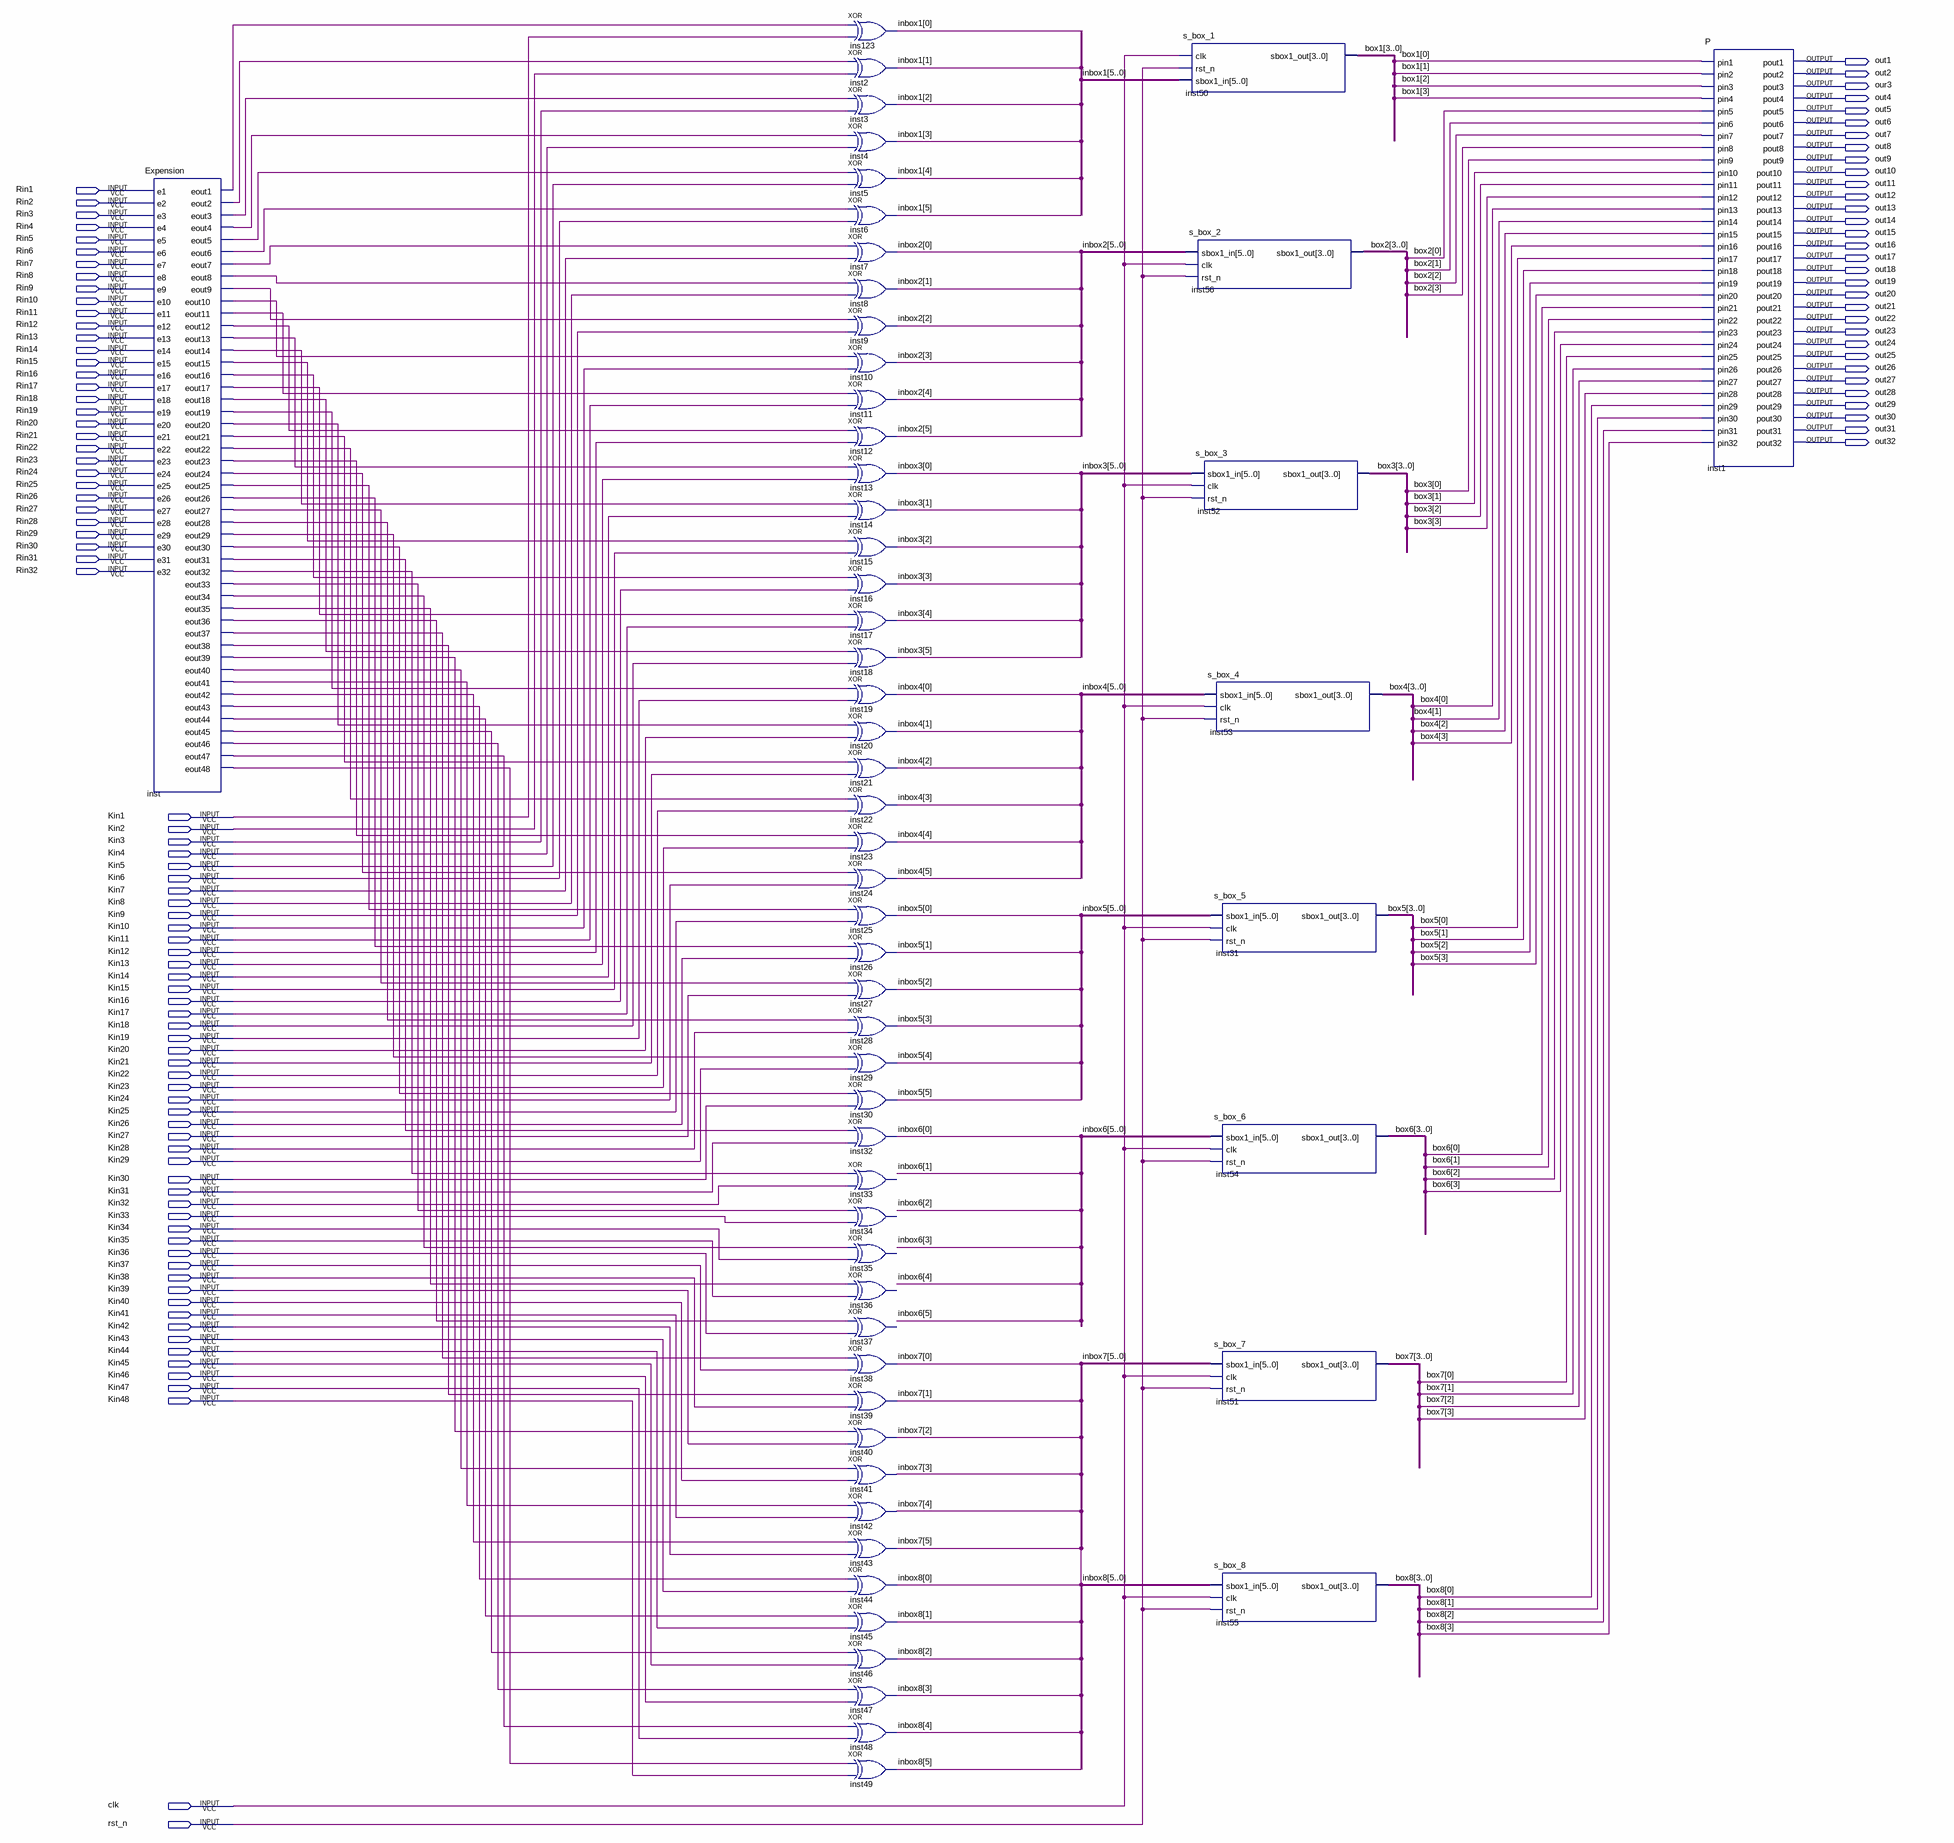
[diagram p0: schematic sheet]
// Quartus schematic f_module.bdf as structural Verilog: 58 symbols, 114 pins
module f_module (
  input  Rin1,
  input  Rin2,
  input  Rin3,
  input  Rin4,
  input  Rin5,
  input  Rin6,
  input  Rin7,
  input  Rin8,
  input  Rin9,
  input  Rin10,
  input  Rin11,
  input  Rin12,
  input  Rin13,
  input  Rin14,
  input  Rin15,
  input  Rin16,
  input  Rin17,
  input  Rin18,
  input  Rin19,
  input  Rin20,
  input  Rin21,
  input  Rin22,
  input  Rin23,
  input  Rin24,
  input  Rin25,
  input  Rin26,
  input  Rin27,
  input  Rin28,
  input  Rin29,
  input  Rin30,
  input  Rin31,
  input  Rin32,
  input  Kin1,
  input  Kin2,
  input  Kin3,
  input  Kin4,
  input  Kin5,
  input  Kin6,
  input  Kin7,
  input  Kin8,
  input  Kin9,
  input  Kin10,
  input  Kin11,
  input  Kin12,
  input  Kin13,
  input  Kin14,
  input  Kin15,
  input  Kin16,
  input  Kin17,
  input  Kin18,
  input  Kin19,
  input  Kin20,
  input  Kin21,
  input  Kin22,
  input  Kin23,
  input  Kin24,
  input  Kin25,
  input  Kin26,
  input  Kin27,
  input  Kin28,
  input  Kin29,
  input  Kin30,
  input  Kin31,
  input  Kin32,
  input  Kin33,
  input  Kin34,
  input  Kin35,
  input  Kin36,
  input  Kin37,
  input  Kin38,
  input  Kin39,
  input  Kin40,
  input  Kin41,
  input  Kin42,
  input  Kin43,
  input  Kin44,
  input  Kin45,
  input  Kin46,
  input  Kin47,
  input  Kin48,
  input  clk,
  input  rst_n,
  output out1,
  output out2,
  output our3,
  output out4,
  output out5,
  output out6,
  output out7,
  output out8,
  output out9,
  output out10,
  output out11,
  output out12,
  output out13,
  output out14,
  output out15,
  output out16,
  output out17,
  output out18,
  output out19,
  output out20,
  output out21,
  output out22,
  output out23,
  output out24,
  output out25,
  output out26,
  output out27,
  output out28,
  output out29,
  output out30,
  output out31,
  output out32
);

  wire inst_eout1, inst_eout2, inst_eout3, inst_eout4, inst_eout5, inst_eout6, inst_eout7, inst_eout8,
       inst_eout9, inst_eout10, inst_eout11, inst_eout12, inst_eout13, inst_eout14, inst_eout15, inst_eout16,
       inst_eout17, inst_eout18, inst_eout19, inst_eout20, inst_eout21, inst_eout22, inst_eout23,
       inst_eout24, inst_eout25, inst_eout26, inst_eout27, inst_eout28, inst_eout29, inst_eout30,
       inst_eout31, inst_eout32, inst_eout33, inst_eout34, inst_eout35, inst_eout36, inst_eout37,
       inst_eout38, inst_eout39, inst_eout40, inst_eout41, inst_eout42, inst_eout43, inst_eout44,
       inst_eout45, inst_eout46, inst_eout47, inst_eout48;
  wire [3:0] box1, box2, box3, box4, box5, box6, box7, box8;
  wire [5:0] inbox1, inbox2, inbox3, inbox4, inbox5, inbox6, inbox7, inbox8;

  Expension inst (
    .e1(Rin1), .e2(Rin2), .e3(Rin3), .e4(Rin4), .e5(Rin5), .e6(Rin6), .e7(Rin7), .e8(Rin8), .e9(Rin9),
    .e10(Rin10), .e11(Rin11), .e12(Rin12), .e13(Rin13), .e14(Rin14), .e15(Rin15), .e16(Rin16), .e17(Rin17),
    .e18(Rin18), .e19(Rin19), .e20(Rin20), .e21(Rin21), .e22(Rin22), .e23(Rin23), .e24(Rin24), .e25(Rin25),
    .e26(Rin26), .e27(Rin27), .e28(Rin28), .e29(Rin29), .e30(Rin30), .e31(Rin31), .e32(Rin32),
    .eout1(inst_eout1), .eout2(inst_eout2), .eout3(inst_eout3), .eout4(inst_eout4), .eout5(inst_eout5),
    .eout6(inst_eout6), .eout7(inst_eout7), .eout8(inst_eout8), .eout9(inst_eout9), .eout10(inst_eout10),
    .eout11(inst_eout11), .eout12(inst_eout12), .eout13(inst_eout13), .eout14(inst_eout14),
    .eout15(inst_eout15), .eout16(inst_eout16), .eout17(inst_eout17), .eout18(inst_eout18),
    .eout19(inst_eout19), .eout20(inst_eout20), .eout21(inst_eout21), .eout22(inst_eout22),
    .eout23(inst_eout23), .eout24(inst_eout24), .eout25(inst_eout25), .eout26(inst_eout26),
    .eout27(inst_eout27), .eout28(inst_eout28), .eout29(inst_eout29), .eout30(inst_eout30),
    .eout31(inst_eout31), .eout32(inst_eout32), .eout33(inst_eout33), .eout34(inst_eout34),
    .eout35(inst_eout35), .eout36(inst_eout36), .eout37(inst_eout37), .eout38(inst_eout38),
    .eout39(inst_eout39), .eout40(inst_eout40), .eout41(inst_eout41), .eout42(inst_eout42),
    .eout43(inst_eout43), .eout44(inst_eout44), .eout45(inst_eout45), .eout46(inst_eout46),
    .eout47(inst_eout47), .eout48(inst_eout48));
  xor ins123 (inbox1[0], inst_eout1, Kin1);
  xor inst2 (inbox1[1], inst_eout2, Kin2);
  xor inst3 (inbox1[2], inst_eout3, Kin3);
  xor inst4 (inbox1[3], inst_eout4, Kin4);
  xor inst5 (inbox1[4], inst_eout5, Kin5);
  xor inst6 (inbox1[5], inst_eout6, Kin6);
  xor inst7 (inbox2[0], inst_eout7, Kin7);
  xor inst8 (inbox2[1], inst_eout8, Kin8);
  xor inst9 (inbox2[2], inst_eout9, Kin9);
  xor inst10 (inbox2[3], inst_eout10, Kin10);
  xor inst11 (inbox2[4], inst_eout11, Kin11);
  xor inst12 (inbox2[5], inst_eout12, Kin12);
  xor inst13 (inbox3[0], inst_eout13, Kin13);
  xor inst14 (inbox3[1], inst_eout14, Kin14);
  xor inst15 (inbox3[2], inst_eout15, Kin15);
  xor inst16 (inbox3[3], inst_eout16, Kin16);
  xor inst17 (inbox3[4], inst_eout17, Kin17);
  xor inst18 (inbox3[5], inst_eout18, Kin18);
  xor inst19 (inbox4[0], inst_eout19, Kin19);
  xor inst20 (inbox4[1], inst_eout20, Kin20);
  xor inst21 (inbox4[2], inst_eout21, Kin21);
  xor inst22 (inbox4[3], inst_eout22, Kin22);
  xor inst23 (inbox4[4], inst_eout23, Kin23);
  xor inst24 (inbox4[5], inst_eout24, Kin24);
  xor inst25 (inbox5[0], inst_eout25, Kin25);
  xor inst26 (inbox5[1], inst_eout26, Kin26);
  xor inst27 (inbox5[2], inst_eout27, Kin27);
  xor inst28 (inbox5[3], inst_eout28, Kin28);
  xor inst29 (inbox5[4], inst_eout29, Kin29);
  xor inst30 (inbox5[5], inst_eout30, Kin30);
  xor inst32 (inbox6[0], inst_eout31, Kin31);
  // XOR inst33 has open pins: IN1=inst_eout32, IN2=Kin32, OUT=open
  // XOR inst34 has open pins: IN1=inst_eout33, IN2=Kin33, OUT=open
  // XOR inst35 has open pins: IN1=inst_eout34, IN2=Kin34, OUT=open
  // XOR inst36 has open pins: IN1=inst_eout35, IN2=Kin35, OUT=open
  // XOR inst37 has open pins: IN1=inst_eout36, IN2=Kin36, OUT=open
  xor inst38 (inbox7[0], inst_eout37, Kin37);
  xor inst39 (inbox7[1], inst_eout38, Kin38);
  xor inst40 (inbox7[2], inst_eout39, Kin39);
  xor inst41 (inbox7[3], inst_eout40, Kin40);
  xor inst42 (inbox7[4], inst_eout41, Kin41);
  xor inst43 (inbox7[5], inst_eout42, Kin42);
  xor inst44 (inbox8[0], inst_eout43, Kin43);
  xor inst45 (inbox8[1], inst_eout44, Kin44);
  xor inst46 (inbox8[2], inst_eout45, Kin45);
  xor inst47 (inbox8[3], inst_eout46, Kin46);
  xor inst48 (inbox8[4], inst_eout47, Kin47);
  xor inst49 (inbox8[5], inst_eout48, Kin48);
  s_box_1 inst50 (.clk(clk), .rst_n(rst_n), .sbox1_in(inbox1), .sbox1_out(box1));
  s_box_2 inst56 (.sbox1_in(inbox2), .clk(clk), .rst_n(rst_n), .sbox1_out(box2));
  s_box_3 inst52 (.sbox1_in(inbox3), .clk(clk), .rst_n(rst_n), .sbox1_out(box3));
  s_box_4 inst53 (.sbox1_in(inbox4), .clk(clk), .rst_n(rst_n), .sbox1_out(box4));
  s_box_5 inst31 (.sbox1_in(inbox5), .clk(clk), .rst_n(rst_n), .sbox1_out(box5));
  s_box_6 inst54 (.sbox1_in(inbox6), .clk(clk), .rst_n(rst_n), .sbox1_out(box6));
  s_box_7 inst51 (.sbox1_in(inbox7), .clk(clk), .rst_n(rst_n), .sbox1_out(box7));
  s_box_8 inst55 (.sbox1_in(inbox8), .clk(clk), .rst_n(rst_n), .sbox1_out(box8));
  P inst1 (
    .pin1(box1[0]), .pin2(box1[1]), .pin3(box1[2]), .pin4(box1[3]), .pin5(box2[0]), .pin6(box2[1]),
    .pin7(box2[2]), .pin8(box2[3]), .pin9(box3[0]), .pin10(box3[1]), .pin11(box3[2]), .pin12(box3[3]),
    .pin13(box4[0]), .pin14(box4[1]), .pin15(box4[2]), .pin16(box4[3]), .pin17(box5[0]), .pin18(box5[1]),
    .pin19(box5[2]), .pin20(box5[3]), .pin21(box6[0]), .pin22(box6[1]), .pin23(box6[2]), .pin24(box6[3]),
    .pin25(box7[0]), .pin26(box7[1]), .pin27(box7[2]), .pin28(box7[3]), .pin29(box8[0]), .pin30(box8[1]),
    .pin31(box8[2]), .pin32(box8[3]), .pout1(out1), .pout2(out2), .pout3(our3), .pout4(out4), .pout5(out5),
    .pout6(out6), .pout7(out7), .pout8(out8), .pout9(out9), .pout10(out10), .pout11(out11), .pout12(out12),
    .pout13(out13), .pout14(out14), .pout15(out15), .pout16(out16), .pout17(out17), .pout18(out18),
    .pout19(out19), .pout20(out20), .pout21(out21), .pout22(out22), .pout23(out23), .pout24(out24),
    .pout25(out25), .pout26(out26), .pout27(out27), .pout28(out28), .pout29(out29), .pout30(out30),
    .pout31(out31), .pout32(out32));
endmodule
